# Altium schematic sheet EG4S20BG256_CoreBoard_A0_NATIVE.SchDoc
size A3; SheetNumber: 1; SheetTotal: 1
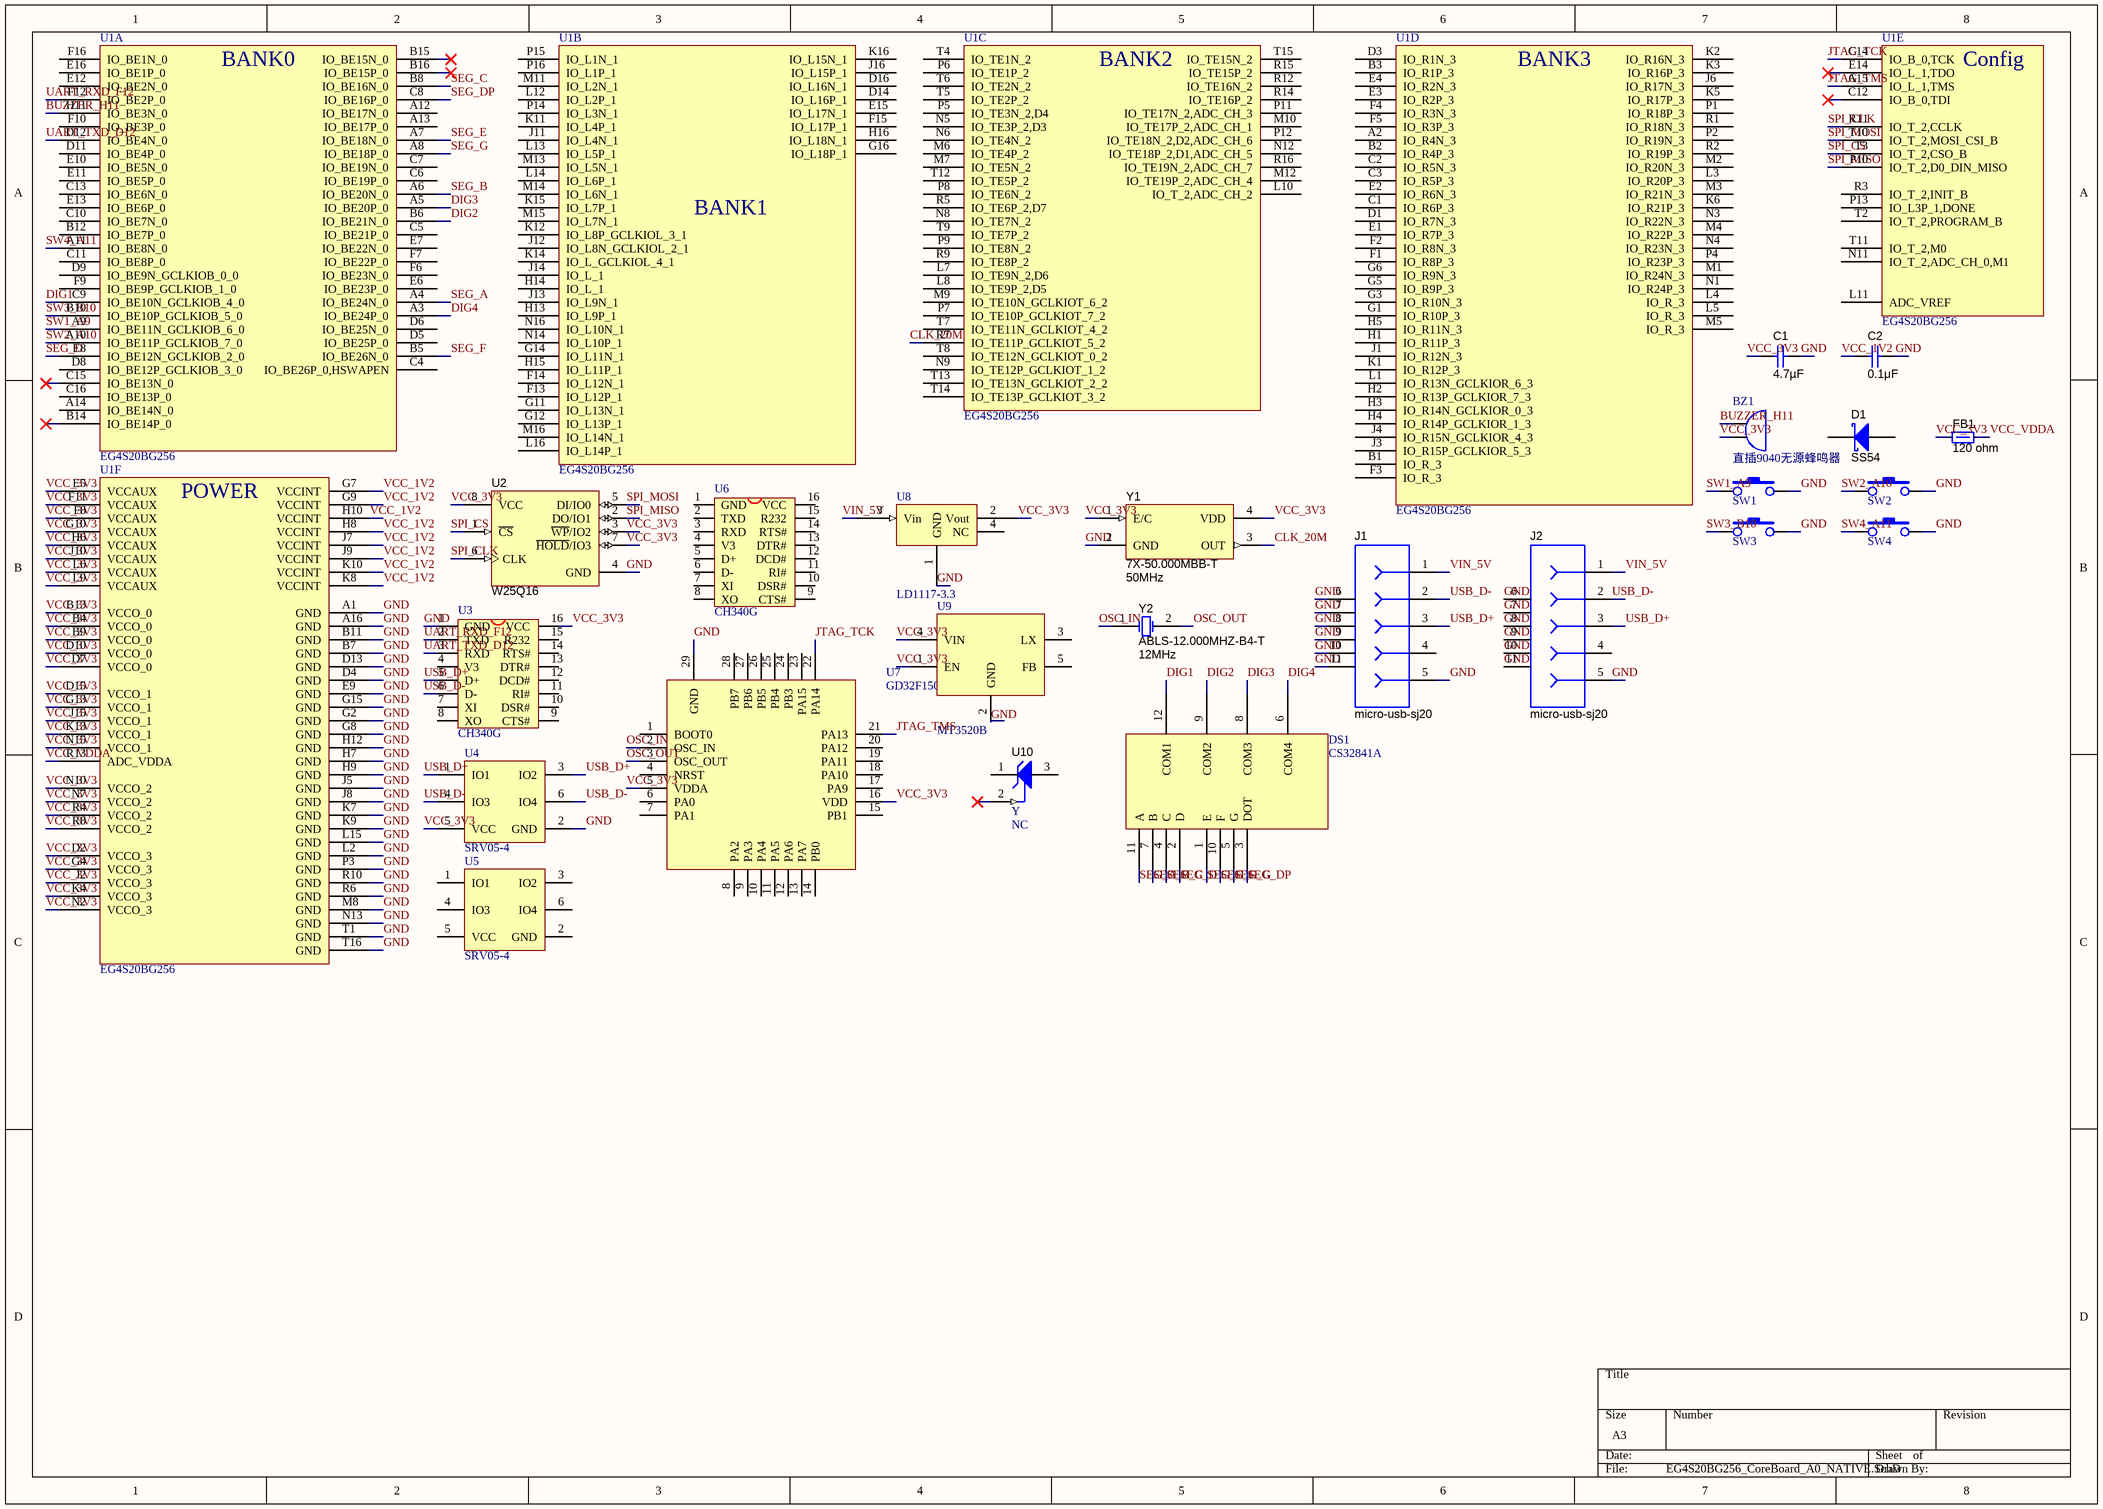
[diagram p0: EG4S20BG256_CoreBoard_A0_NATIVE.SchDoc]

## Parts
BZ1  直插9040无源蜂鸣器  [BUZZER_9*9_4MM]
C1  ValueDisplayed: 4.7µF  [0805_HV]  (hidden comment: GRM21BC81C475KA88L)
C2  ValueDisplayed: 0.1μF  [0402]  (hidden comment: C1005X7R1H104M)
D1  SS54  [SMB]
DS1  CS32841A  [CS2845AUR]
FB1  value 120 ohm  [0805_HV]  (hidden comment: GZ2012V121TF)
J1  micro-usb-sj20  [YQMICRO-USB-SJ20]
J2  micro-usb-sj20  [YQMICRO-USB-SJ20]
SW1  贴片按键  [BUTTOM_T_6*6 *4.3]  (value not drawn)
SW2  贴片按键  [BUTTOM_T_6*6 *4.3]  (value not drawn)
SW3  贴片按键  [BUTTOM_T_6*6 *4.3]  (value not drawn)
SW4  贴片按键  [BUTTOM_T_6*6 *4.3]  (value not drawn)
U1  EG4S20BG256  [FBGA256]  (parts A,B,C,D,E,F of 6)
U2  W25Q16  [MICT-MW-8_N]
U3  CH340G  [SOP16M]
U4  SRV05-4  [DBV0006A_N]
U5  SRV05-4  [DBV0006A_N]
U6  CH340G  [SOP16M]
U7  GD32F150G8U6  [WQFN-28_L4.0-W4.0-P0.40-BL-EP]
U8  LD1117-3.3  [SOT223-L]
U9  MT3520B  [DBV0005A_N]
U10  Parameter 1: NC  [DBZ0003A_N]  (hidden comment: Y)
Y1  7X-50.000MBB-T  Frequency: 50MHz  [XTAL_NX3225SA]
Y2  ABLS-12.000MHZ-B4-T  Frequency: 12MHz  [YQ_OSC5032]

## Nets
BUZZER_H11: BZ1.1 U1.H11(IO_BE3N_0)
CLK_20M: U1.R7(IO_TE11P_GCLKIOT_5_2) Y1.3(OUT)
DIG1: DS1.12(COM1) U1.C9(IO_BE10N_GCLKIOB_4_0)
DIG2: DS1.9(COM2) U1.B6(IO_BE21N_0)
DIG3: DS1.8(COM3) U1.A5(IO_BE20P_0)
DIG4: DS1.6(COM4) U1.A3(IO_BE24P_0)
GND: C1.1 C2.1 J1.5 J1.6 J1.7 J1.8 J1.9 J1.10 J1.11 J2.5 J2.6 J2.7 J2.8 J2.9 J2.10 J2.11 SW1.2 SW2.2 SW3.2 SW4.2 U1.A1(GND) U1.A16(GND) U1.B7(GND) U1.B11(GND) U1.D4(GND) U1.D13(GND) U1.E9(GND) U1.G2(GND) U1.G8(GND) U1.G15(GND) U1.H7(GND) U1.H9(GND) U1.H12(GND) U1.J5(GND) U1.J8(GND) U1.K7(GND) U1.K9(GND) U1.L2(GND) U1.L15(GND) U1.M8(GND) U1.N13(GND) U1.P3(GND) U1.R6(GND) U1.R10(GND) U1.T1(GND) U1.T16(GND) U2.4(GND) U3.1(GND) U4.2(GND) U7.29(GND) U8.1(GND) U9.2(GND) Y1.2(GND)
JTAG_TCK: U1.C14(IO_B_0,TCK) U7.22(PA14)
JTAG_TMS: U1.A15(IO_L_1,TMS) U7.21(PA13)
OSC_IN: U7.2(OSC_IN) Y2.1(OSC1)
OSC_OUT: U7.3(OSC_OUT) Y2.2(OSC2)
SEG_A: DS1.11(A) U1.A4(IO_BE24N_0)
SEG_B: DS1.7(B) U1.A6(IO_BE20N_0)
SEG_C: DS1.4(C) U1.B8(IO_BE16N_0)
SEG_D: DS1.2(D) U1.E8(IO_BE12N_GCLKIOB_2_0)
SEG_DP: DS1.3(DOT) U1.C8(IO_BE16P_0)
SEG_E: DS1.1(E) U1.A7(IO_BE18N_0)
SEG_F: DS1.10(F) U1.B5(IO_BE26N_0)
SEG_G: DS1.5(G) U1.A8(IO_BE18P_0)
SPI_CLK: U1.R11(IO_T_2,CCLK) U2.6(CLK)
SPI_CS: U1.T3(IO_T_2,CSO_B) U2.1(~{CS})
SPI_MISO: U1.P10(IO_T_2,D0_DIN_MISO) U2.2(DO/IO1)
SPI_MOSI: U1.T10(IO_T_2,MOSI_CSI_B) U2.5(DI/IO0)
SW1_A9: SW1.1 U1.A9(IO_BE11N_GCLKIOB_6_0)
SW2_A10: SW2.1 U1.A10(IO_BE11P_GCLKIOB_7_0)
SW3_B10: SW3.1 U1.B10(IO_BE10P_GCLKIOB_5_0)
SW4_A11: SW4.1 U1.A11(IO_BE8N_0)
UART_RXD_F12: U1.F12(IO_BE2P_0) U3.2(TXD)
UART_TXD_D12: U1.D12(IO_BE4N_0) U3.3(RXD)
USB_D+: J1.3 J2.3 U3.5(D+) U4.1(IO1) U4.3(IO2)
USB_D-: J1.2 J2.2 U3.6(D-) U4.4(IO3) U4.6(IO4)
VCC_1V2: C2.2 U1.G7(VCCINT) U1.G9(VCCINT) U1.H8(VCCINT) U1.H10(VCCINT) U1.J7(VCCINT) U1.J9(VCCINT) U1.K8(VCCINT) U1.K10(VCCINT)
VCC_3V3: BZ1.2 C1.2 FB1.1 U1.B4(VCCO_0) U1.B9(VCCO_0) U1.B13(VCCO_0) U1.D2(VCCO_3) U1.D7(VCCO_0) U1.D10(VCCO_0) U1.D15(VCCO_1) U1.E5(VCCAUX) U1.F8(VCCAUX) U1.F11(VCCAUX) U1.G4(VCCO_3) U1.G10(VCCAUX) U1.G13(VCCO_1) U1.H6(VCCAUX) U1.J2(VCCO_3) U1.J10(VCCAUX) U1.J15(VCCO_1) U1.K4(VCCO_3) U1.K13(VCCO_1) U1.L6(VCCAUX) U1.L9(VCCAUX) U1.N2(VCCO_3) U1.N7(VCCO_2) U1.N10(VCCO_2) U1.N15(VCCO_1) U1.R4(VCCO_2) U1.R8(VCCO_2) U2.3(~{WP}/IO2) U2.7(~{HOLD}/IO3) U2.8(VCC) U3.16(VCC) U4.5(VCC) U7.5(VDDA) U7.16(VDD) U8.2(Vout) U9.1(EN) U9.4(VIN) Y1.1(E/C) Y1.4(VDD)
VCC_VDDA: FB1.2 U1.R13(ADC_VDDA)
VIN_5V: J1.1 J2.1 U8.3(Vin)

Not connected (* = marked no-connect by the designer): D1 1(K) 2(A); J1 4; J2 4; U1 A2(IO_R4N_3) A12(IO_BE17N_0) A13(IO_BE17P_0) A14(IO_BE14N_0) B1(IO_R_3) B2(IO_R4P_3) B3(IO_R1P_3) B12(IO_BE7P_0) B14(IO_BE14P_0)* B15(IO_BE15N_0)* B16(IO_BE15P_0)* C1(IO_R6P_3) C2(IO_R5N_3) C3(IO_R5P_3) C4(IO_BE26P_0,HSWAPEN) C5(IO_BE21P_0) C6(IO_BE19P_0) C7(IO_BE19N_0) C10(IO_BE7N_0) C11(IO_BE8P_0) C12(IO_B_0,TDI)* C13(IO_BE6N_0) C15(IO_BE13N_0)* C16(IO_BE13P_0) D1(IO_R7N_3) D3(IO_R1N_3) D5(IO_BE25P_0) D6(IO_BE25N_0) D8(IO_BE12P_GCLKIOB_3_0) D9(IO_BE9N_GCLKIOB_0_0) D11(IO_BE4P_0) D14(IO_L16P_1) D16(IO_L16N_1) E1(IO_R7P_3) E2(IO_R6N_3) E3(IO_R2P_3) E4(IO_R2N_3) E6(IO_BE23P_0) E7(IO_BE22N_0) E10(IO_BE5N_0) E11(IO_BE5P_0) E12(IO_BE2N_0) E13(IO_BE6P_0) E14(IO_L_1,TDO)* E15(IO_L17N_1) E16(IO_BE1P_0) F1(IO_R8P_3) F2(IO_R8N_3) F3(IO_R_3) F4(IO_R3N_3) F5(IO_R3P_3) F6(IO_BE23N_0) F7(IO_BE22P_0) F9(IO_BE9P_GCLKIOB_1_0) F10(IO_BE3P_0) F13(IO_L12P_1) F14(IO_L12N_1) F15(IO_L17P_1) F16(IO_BE1N_0) G1(IO_R10P_3) G3(IO_R10N_3) G5(IO_R9P_3) G6(IO_R9N_3) G11(IO_L13N_1) G12(IO_L13P_1) G14(IO_L11N_1) G16(IO_L18P_1) H1(IO_R11P_3) H2(IO_R13P_GCLKIOR_7_3) H3(IO_R14N_GCLKIOR_0_3) H4(IO_R14P_GCLKIOR_1_3) H5(IO_R11N_3) H13(IO_L9P_1) H14(IO_L_1) H15(IO_L11P_1) H16(IO_L18N_1) J1(IO_R12N_3) J3(IO_R15P_GCLKIOR_5_3) J4(IO_R15N_GCLKIOR_4_3) J6(IO_R17N_3) J11(IO_L4N_1) J12(IO_L8N_GCLKIOL_2_1) J13(IO_L9N_1) J14(IO_L_1) J16(IO_L15P_1) K1(IO_R12P_3) K2(IO_R16N_3) K3(IO_R16P_3) K5(IO_R17P_3) K6(IO_R21P_3) K11(IO_L4P_1) K12(IO_L8P_GCLKIOL_3_1) K14(IO_L_GCLKIOL_4_1) K15(IO_L7P_1) K16(IO_L15N_1) L1(IO_R13N_GCLKIOR_6_3) L3(IO_R20P_3) L4(IO_R_3) L5(IO_R_3) L7(IO_TE9N_2,D6) L8(IO_TE9P_2,D5) L10(IO_T_2,ADC_CH_2) L11(ADC_VREF) L12(IO_L2P_1) L13(IO_L5P_1) L14(IO_L6P_1) L16(IO_L14P_1) M1(IO_R24N_3) M2(IO_R20N_3) M3(IO_R21N_3) M4(IO_R22P_3) M5(IO_R_3) M6(IO_TE4P_2) M7(IO_TE5N_2) M9(IO_TE10N_GCLKIOT_6_2) M10(IO_TE17P_2,ADC_CH_1) M11(IO_L2N_1) M12(IO_TE19P_2,ADC_CH_4) M13(IO_L5N_1) M14(IO_L6N_1) M15(IO_L7N_1) M16(IO_L14N_1) N1(IO_R24P_3) N3(IO_R22N_3) N4(IO_R23N_3) N5(IO_TE3P_2,D3) N6(IO_TE4N_2) N8(IO_TE7N_2) N9(IO_TE12P_GCLKIOT_1_2) N11(IO_T_2,ADC_CH_0,M1) N12(IO_TE18P_2,D1,ADC_CH_5) N14(IO_L10P_1) N16(IO_L10N_1) P1(IO_R18P_3) P2(IO_R19N_3) P4(IO_R23P_3) P5(IO_TE3N_2,D4) P6(IO_TE1P_2) P7(IO_TE10P_GCLKIOT_7_2) P8(IO_TE6N_2) P9(IO_TE8N_2) P11(IO_TE17N_2,ADC_CH_3) P12(IO_TE18N_2,D2,ADC_CH_6) P13(IO_L3P_1,DONE) P14(IO_L3N_1) P15(IO_L1N_1) P16(IO_L1P_1) R1(IO_R18N_3) R2(IO_R19P_3) R3(IO_T_2,INIT_B) R5(IO_TE6P_2,D7) R9(IO_TE8P_2) R12(IO_TE16N_2) R14(IO_TE16P_2) R15(IO_TE15P_2) R16(IO_TE19N_2,ADC_CH_7) T2(IO_T_2,PROGRAM_B) T4(IO_TE1N_2) T5(IO_TE2P_2) T6(IO_TE2N_2) T7(IO_TE11N_GCLKIOT_4_2) T8(IO_TE12N_GCLKIOT_0_2) T9(IO_TE7P_2) T11(IO_T_2,M0) T12(IO_TE5P_2) T13(IO_TE13N_GCLKIOT_2_2) T14(IO_TE13P_GCLKIOT_3_2) T15(IO_TE15N_2); U3 4(V3) 7(XI) 8(XO) 9(CTS#) 10(DSR#) 11(RI#) 12(DCD#) 13(DTR#) 14(RTS#) 15(R232); U5 1(IO1) 2(GND) 3(IO2) 4(IO3) 5(VCC) 6(IO4); U6 1(GND) 2(TXD) 3(RXD) 4(V3) 5(D+) 6(D-) 7(XI) 8(XO) 9(CTS#) 10(DSR#) 11(RI#) 12(DCD#) 13(DTR#) 14(RTS#) 15(R232) 16(VCC); U7 1(BOOT0) 4(NRST) 6(PA0) 7(PA1) 8(PA2) 9(PA3) 10(PA4) 11(PA5) 12(PA6) 13(PA7) 14(PB0) 15(PB1) 17(PA9) 18(PA10) 19(PA11) 20(PA12) 23(PA15) 24(PB3) 25(PB4) 26(PB5) 27(PB6) 28(PB7); U8 4(NC); U9 3(LX) 5(FB); U10 1(CATHODE) 2(REF)* 3(ANODE)

## Notes on the sheet
- (near U1) USB_D+
- (near U1) USB_D-
- (in symbol EG4S20BG256, part A) BANK0
- (in symbol EG4S20BG256, part B) BANK1
- (in symbol EG4S20BG256, part C) BANK2
- (in symbol EG4S20BG256, part D) BANK3
- (in symbol EG4S20BG256, part E) Config
- (in symbol EG4S20BG256, part F) POWER

## Library data of the parts
BZ1 = BUZZER_EFBAA14D001: Buzzer, 74 dB min, 25V p-p, 8500pF @ 1kHz，直插9040无源蜂鸣器; Manufacturer: Panasonic; Area: 264,208; Value: {Value}; ComponentHeight: 0.276 inch; PackageReference: 0.550 DIA.; SymbolVersion: 07/31/2009 12:17:27; PartNumber: 直插9040无源蜂鸣器; ComponentLink1Description: AEO Datasheet Link
C1 = GRM21BC81C475KA88L: CAP, CERM, 4.7 µF, 16 V, +/- 10%, X6S, 0805; Manufacturer: MuRata; Polarized: N; CompType: Capacitor; Value: 4.7uF; U/M: EA; Cap_F: 0.0000047; Tolerance_%: 10; Value1: Unknown; VDC_V: 16; Value2: 16V; TaMin_C: -55; TaMax_C: 105; Cap_Case: 0805; SymbolVersion: 2008-07-09; PartNumber: GRM21BC81C475KA88L; PackageReference: 0805; RoHS: Y; MountType: SMT; Technology: Ceramic; TempCo: X6S; Published: 2008-06-19; Publisher: Texas Instruments; LatestRevisionDate: 2015-05-02; ComponentLink1Description: Datasheet link; ComponentLink1URL: http://search.murata.co.jp/Ceramy/PnsearchViewAction.do?HnOFG=ON&HnNFG=ON&SEL_CNT=50&sLang=en&sKey=GRM21BC81C475KA88L&x=9&y=9&search=startwith; Supplier 1: Digi-Key; Supplier Part Number 1: GRM21BC81C475KA88L-ND; Supplier 2: Mouser; Supplier Part Number 2: 81-GRM21BC81C475KA8L; Supplier 3: Farnell; Supplier Part Number 3: 1889279
C2 = C1005X7R1H104M_1: CAP, CERM, 0.1 μF, 50 V, +/- 20%, X7R, 0402; Manufacturer: TDK; Polarized: N; CompType: Capacitor; Value: 0.1uF; U/M: EA; Cap_F: 0.0000001; Tolerance_%: 20; Value1: Unknown; VDC_V: 50; Value2: 50V; TaMin_C: -55; TaMax_C: 125; SymbolVersion: 2008-07-09; PartNumber: C1005X7R1H104M; PackageReference: 0402; RoHS: Y; MountType: SMT; Technology: Ceramic; TempCo: X7R; Cap_Case: 0402; Published: 2008-06-19; Publisher: Texas Instruments; LatestRevisionDate: 2015-05-02; ComponentLink1Description: Datasheet link; Supplier 1: Digi-Key; Supplier Part Number 1: 445-5933-1-ND; Supplier 2: Farnell; Supplier Part Number 2: 1907278
D1 = B340B-13-F: Diode, Schottky, 40 V, 3A, SMB; Manufacturer: Diodes Inc.; U/M: EA; Vf_V: 0.5; Value: 40V; Value2: 0.5V; Io_A: 3; Vr_V: 40; TJmax_C: 125; RJC_CperW: 25; CompType: Diode; SymbolVersion: 2008-12-08; PartNumber: SS54; PackageReference: SMB; Value1: 3A; MountType: SMT; Type: Schottky; RoHS: Y; Published: 2008-06-26; Publisher: Texas Instruments; LatestRevisionDate: 2015-04-30; ComponentLink1Description: Datasheet link; ComponentLink1URL: http://www.diodes.com/datasheets/ds30924.pdf; Supplier 1: Digi-Key; Supplier Part Number 1: B340B-FDICT-ND; Supplier 2: Mouser; Supplier Part Number 2: 621-B340B-F; Supplier 3: Farnell; Supplier Part Number 3: 1843677
DS1 = 4LED-ANODE: 4位共阴数码管，红色
FB1 = BLM21BD121SN1D: Ferrite Bead, 120 ohm @ 100 MHz, 0.2 A, 0805; Manufacturer: MuRata; Imax_A: 0.2; DCR_ohm: 0.25; Value1: 0.25 ohm; Value2: 0.2A; ZTyp@100MHz_Ohm: 120; CompType: Ferrite Bead; SymbolVersion: 2009-06-02; PartNumber: GZ2012V121TF; MountType: SMT; PackageReference: 0805; Published: 2014-04-30; Publisher: Texas Instruments; LatestRevisionDate: 2015-05-01; ComponentLink1Description: Datasheet link; ComponentLink1URL: http://search.murata.co.jp/Ceramy/image/img/PDF/ENG/L0110S0100BLM21B.pdf; RoHS: Y; Supplier 1: Digi-Key; Supplier Part Number 1: 490-1044-1-ND; Supplier 2: Mouser; Supplier Part Number 2: 81-BLM21BD121SN1D; Supplier 3: Farnell; Supplier Part Number 3: 1515637
J1 J2 = 105017-0001: Receptacle, Micro-USB-B, Right Angle, SMD; Manufacturer: Molex; SymbolCreator: a0412235; CompType: Connector; U/M: EA; SymbolVersion: 2012-12-19; PartNumber: micro-usb-sj20; RoHS: Y; PackageReference: Micro USB receptacle; MountType: SMT; ComponentLink1Description: Datasheet Link; ComponentLink1URL: http://www.molex.com/pdm_docs/sd/1050170001_sd.pdf; Publisher: Texas Instruments; LatestRevisionDate: 2012-12-26; LatestRevisionNote: Added parts, moved some to Hardware.IntLib; Supplier 1: Digi-Key; Supplier Part Number 1: WM1399CT-ND; Supplier 2: Mouser; Supplier Part Number 2: 538-105017-0001; Supplier 3: Farnell; Supplier Part Number 3: 1847433
SW1-SW4 = SW-PB: 米黄色圆形按键6*6*3.4
U2 = W25Q80BLSNIG: 2.5V 8M-Bit Serial Flash Memory with Dual and Quad SPI, SOIC-8; Manufacturer: Winbond; SymbolCreator: Altium; SymbolVersion: 2015-04-01; PartNumber: W25Q16; MountType: SMT; ComponentLink1Description: Datasheet Link; ComponentLink1URL: http://www.winbond.com/resource-files/da00-w25q80blf1.pdf; RoHS: Y; PackageReference: SOIC-8; Publisher: Texas Instruments; LatestRevisionDate: 2015-05-05; Supplier 1: Digi-Key; Supplier Part Number 1: W25Q80BLSNIG-ND
U3 U6 = CH340G: USB2UART
U4 U5 = TPD4E001DBVR: Low-Capacitance + / - 15-kV ESD Protection Array for High-Speed Data Interfaces, 4 Channels, -40 to +85 degC, 6-pin SOT-23 (DBV), Green (RoHS & no Sb/Br); Manufacturer: Texas Instruments; Alternate Manufacturer: None; Alternate PartNumber: Equivalent; 1394 / Firewire: TRUE; Breakdown Voltage(Min)(V): 11; IEC 61000-4-2 Air-Gap(+/- kV): 15; IEC 61000-4-2 Contact(+/- kV): 8; IO Capacitance(Typ)(pF): 1.5; SubFamily: ESD Solution; DatasheetVersion: SLLS682G; PackageVersion: revK, Mar-2006; PackageReference: DBV0006A; PackageDescription: 6-Pin Plastic Small-Outline Package, 2.9 x 1.6 mm Body, 0.95 mm Pitch, 2.8 mm Lead Span; Supplier 1: Digi-Key; Supplier Part Number 1: 296-28203-2-ND; Supplier 2: Digi-Key; Supplier Part Number 2: 296-28203-1-ND; Supplier 3: Digi-Key; Supplier Part Number 3: 296-28203-6-ND; Supplier 4: Newark; Supplier Part Number 4: 27T6836; Supplier 5: Mouser; Supplier Part Number 5: 595-TPD4E001DBVR; Eco-Plan: Green (RoHS & no Sb/Br); IO Leakage Current(nA): 1.5; Serial ATA / eSATA: TRUE; USB High Speed: TRUE; MountType: SMT; Code_JEDEC: MO-178-AB*; PartNumber: TPD4E001DBVR; ComponentLink1Description: Datasheet; ComponentLink1URL: http://www.ti.com/general/docs/lit/getliterature.tsp?genericPartNumber=TPD4E001&fileType=pdf; ComponentLink2Description: URL Link1; ComponentLink2URL: SamplesURL:http://www.ti.com/product/tpd4e001#samples
U7 = GD32F150U: ComponentLink1Description: Manufacturer URL; ComponentLink1URL: http://www.ti.com/; ComponentLink2Description: Datasheet; ComponentLink2URL: http://www.ti.com/general/docs/lit/getliterature.tsp?genericPartNumber=DAC904&fileType=pdf; ComponentLink3Description: Package Specification; ComponentLink3URL: http://www.ti.com/litv/pdf/mpds364
U8 = AMS1117: LDO电源
U9 = RT8097: 1MHZ,2A,STEP-DOWM DC/DC; Partnumber: MT3520B
U10 = TL431AIDBZ: PRECISION PROGRAMMABLE REFERENCE, DBZ0003A; Manufacturer: Texas Instruments; SymbolCreator: a0412235; CompType: IC; U/M: EA; SymbolVersion: 2013-02-15; PartNumber: TL431AIDBZ; PackageReference: DBZ0003A; MountType: SMT; ComponentLink1Description: Datasheet Link; ComponentLink1URL: http://www.ti.com/lit/ds/symlink/tl431.pdf; RoHS: Y; Publisher: Texas Instruments; LatestRevisionDate: 2015-05-05; Alternate Manufacturer: Texas Instruments; IGNORE: Y
Y1 = 7X-20.000MBB-T_1: Crystal, 有源晶振，Sealed Locked 50MHz, 15pF, SMD; Manufacturer: TXC Corporation; SymbolCreator: a0799628; CompType: Oscillator; U/M: EA; TaMin_C: -40; TaMax_C: 85; Frequency Stability: ?ppm; SymbolVersion: 2013-06-14; PartNumber: 7X-50.000MBB-T; PackageReference: 3.2x1x2.5 mm; MountType: SMT; RoHS: Y; ComponentLink1Description: Datasheet Link; ComponentLink1URL: http://www.txccrystal.com/images/pdf/7x.pdf; Publisher: Texas Instruments; LatestRevisionDate: 2013-06-18; LatestRevisionNote: Changed publisher; Supplier 1: Digi-Key; Supplier Part Number 1: 887-1217-1-ND; Supplier 2: Mouser; Supplier Part Number 2: 717-7X-20.000MBB-T; Supplier 3: Farnell; Supplier Part Number 3: 1842164
Y2 = ABLS-8.000MHZ-B4-T: Crystal, 12MHz, 18pF, SMD,无源; Manufacturer: Abracon Corportation; SymbolCreator: a0412235; U/M: EA; TaMin_C: 0; TaMax_C: 70; Frequency Stability: ±50ppm; SymbolVersion: 2008-07-09; PartNumber: ABLS-12.000MHZ-B4-T; CompType: Crystal; PackageReference: Crystal, 11.4x4.3x3.8mm; MountType: SMT; RoHS: Y; ComponentLink1Description: Datasheet Link; ComponentLink1URL: http://www.abracon.com/Resonators/abls.pdf; Publisher: Texas Instruments; LatestRevisionDate: 2015-05-05; Supplier 1: Digi-Key; Supplier Part Number 1: 535-10212-1-ND; Supplier 2: Mouser; Supplier Part Number 2: 815-ABLS-8.0M-T